# EAGLE schematic 005 (EAGLE 9.6.2)
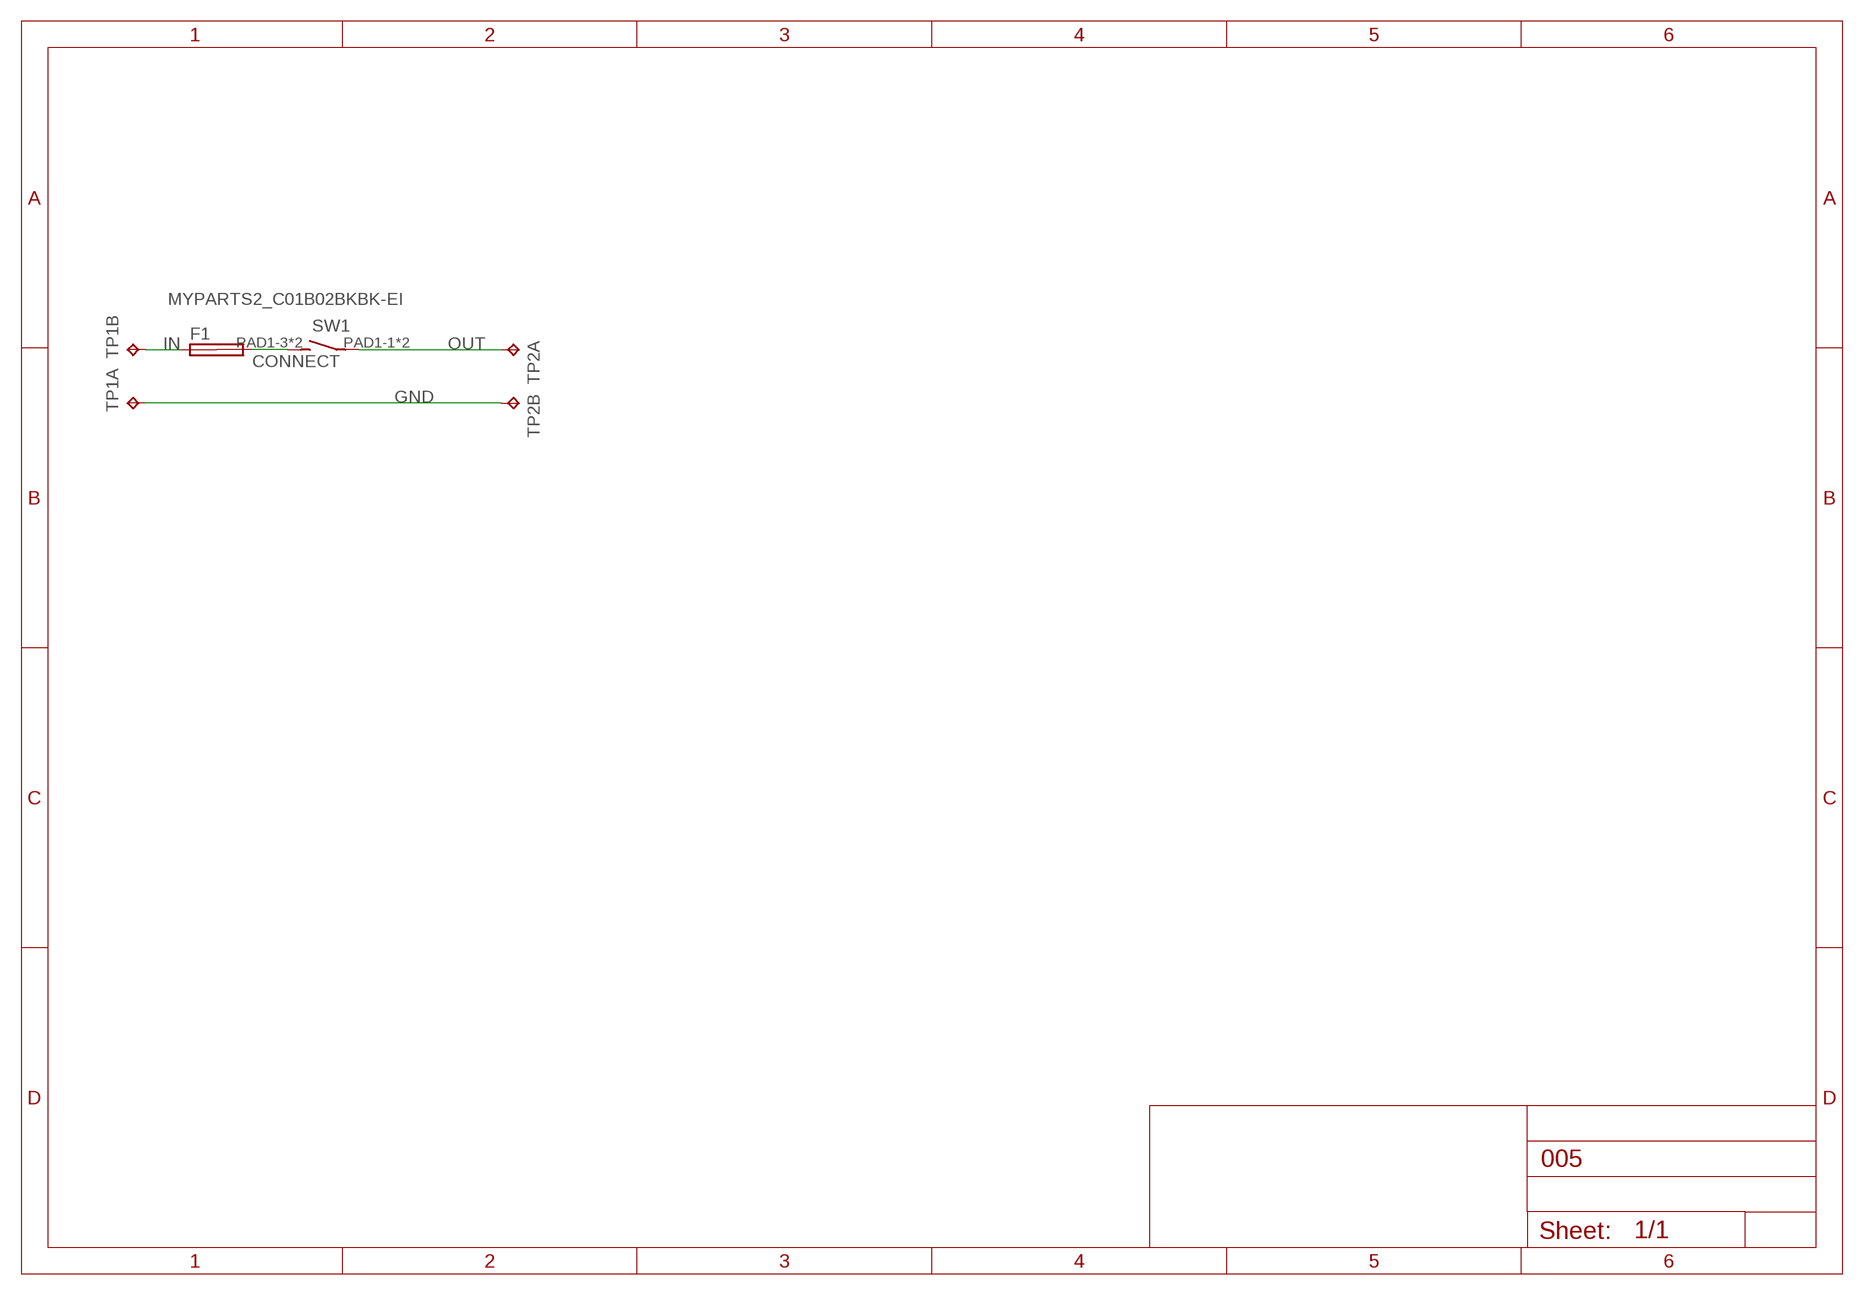
[diagram p0: schematic, sheet 1]

## Parts
F1  SHK20L  [SHK20L]
SW1  MYPARTS2_C01B02BKBK-EI  [MYPARTS2_C01B02BKBK-EI]
TP1  TP2P2-38-20  [P2-38-20]
TP2  TP2P2-38-20  [P2-38-20]

## Nets
CONNECT: F1.2A SW1.PAD1-3(S) SW1.PAD1-4(S)
GND: TP1.TP-1 TP2.TP-2
IN: F1.1A TP1.TP-2
OUT: SW1.PAD1-1(P) SW1.PAD1-2(P) TP2.TP-1
Unconnected: F1.1B F1.2B

## Library data of the parts
F1 = fuse:SHK20L: FUSE HOLDER 5 x 20 mm, SH contact, SHH1 Schukat, E1073 Buerklin; OC_FARNELL: unknown; OC_NEWARK: unknown
SW1 = #004-high_voltage:MYPARTS2_C01B02BKBK-EI
TP1 TP2 = testpad:TP2: Test pad

## Net classes
0 default: clearance 0.508 mm